# EAGLE design PQ60-BRK (EAGLE 7.2.0)
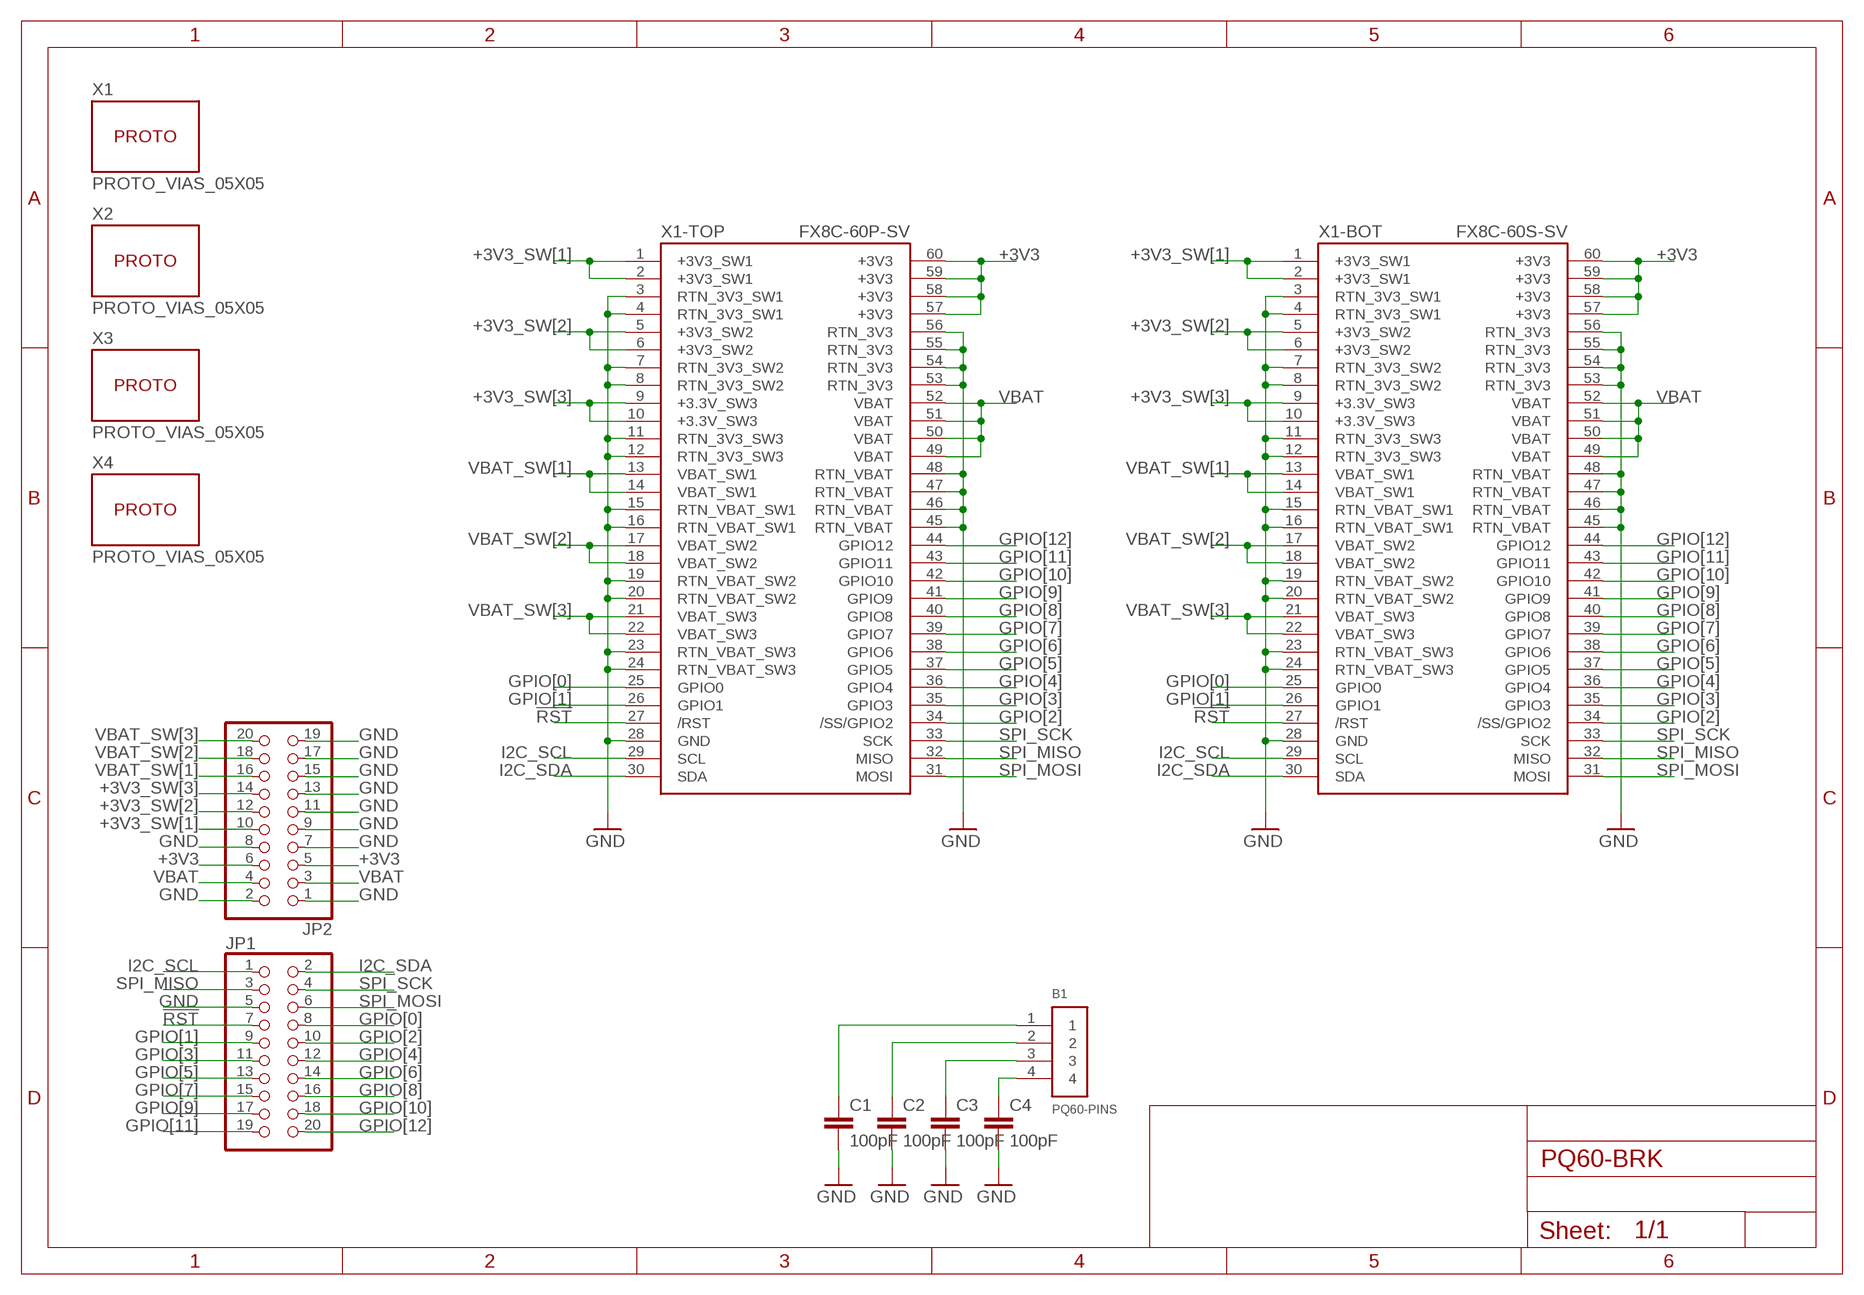
[diagram p0: schematic, sheet 1]

## Parts
B1  PQ60-PINS  [PQ60_PINS]
C1  100pF  C-EUC0402  [C0402]
C2  100pF  C-EUC0402  [C0402]
C3  100pF  C-EUC0402  [C0402]
C4  100pF  C-EUC0402  [C0402]
JP1  PINHD-2X10  [2X10]
JP2  PINHD-2X10  [2X10]
X1  PROTO_VIAS_05X05  [PROTO_VIAS_05X05]
X1-BOT  FX8C-60S-SV  FX8C-60-R2S-SV  [FX8C-60S-SV]
X1-TOP  FX8C-60P-SV  FX8C-60-R2P-SV  [FX8C-60P-SV]
X2  PROTO_VIAS_05X05  [PROTO_VIAS_05X05]
X3  PROTO_VIAS_05X05  [PROTO_VIAS_05X05]
X4  PROTO_VIAS_05X05  [PROTO_VIAS_05X05]

## Nets
!RST: JP1.7 X1-BOT.27(/RST) X1-TOP.27(/RST)
+3V3: JP2.5 JP2.6 X1-BOT.57(+3V3) X1-BOT.58(+3V3) X1-BOT.59(+3V3) X1-BOT.60(+3V3) X1-TOP.57(+3V3) X1-TOP.58(+3V3) X1-TOP.59(+3V3) X1-TOP.60(+3V3)
+3V3_SW[1]: JP2.10 X1-BOT.1(+3V3_SW1) X1-BOT.2(+3V3_SW1) X1-TOP.1(+3V3_SW1) X1-TOP.2(+3V3_SW1)
+3V3_SW[2]: JP2.12 X1-BOT.5(+3V3_SW2) X1-BOT.6(+3V3_SW2) X1-TOP.5(+3V3_SW2) X1-TOP.6(+3V3_SW2)
+3V3_SW[3]: JP2.14 X1-BOT.9(+3.3V_SW3) X1-BOT.10(+3.3V_SW3) X1-TOP.9(+3.3V_SW3) X1-TOP.10(+3.3V_SW3)
GND: C1.2 C2.2 C3.2 C4.2 JP1.5 JP2.1 JP2.2 JP2.7 JP2.8 JP2.9 JP2.11 JP2.13 JP2.15 JP2.17 JP2.19 X1-BOT.3(RTN_3V3_SW1) X1-BOT.4(RTN_3V3_SW1) X1-BOT.7(RTN_3V3_SW2) X1-BOT.8(RTN_3V3_SW2) X1-BOT.11(RTN_3V3_SW3) X1-BOT.12(RTN_3V3_SW3) X1-BOT.15(RTN_VBAT_SW1) X1-BOT.16(RTN_VBAT_SW1) X1-BOT.19(RTN_VBAT_SW2) X1-BOT.20(RTN_VBAT_SW2) X1-BOT.23(RTN_VBAT_SW3) X1-BOT.24(RTN_VBAT_SW3) X1-BOT.28(GND) X1-BOT.45(RTN_VBAT) X1-BOT.46(RTN_VBAT) X1-BOT.47(RTN_VBAT) X1-BOT.48(RTN_VBAT) X1-BOT.53(RTN_3V3) X1-BOT.54(RTN_3V3) X1-BOT.55(RTN_3V3) X1-BOT.56(RTN_3V3) X1-TOP.3(RTN_3V3_SW1) X1-TOP.4(RTN_3V3_SW1) X1-TOP.7(RTN_3V3_SW2) X1-TOP.8(RTN_3V3_SW2) X1-TOP.11(RTN_3V3_SW3) X1-TOP.12(RTN_3V3_SW3) X1-TOP.15(RTN_VBAT_SW1) X1-TOP.16(RTN_VBAT_SW1) X1-TOP.19(RTN_VBAT_SW2) X1-TOP.20(RTN_VBAT_SW2) X1-TOP.23(RTN_VBAT_SW3) X1-TOP.24(RTN_VBAT_SW3) X1-TOP.28(GND) X1-TOP.45(RTN_VBAT) X1-TOP.46(RTN_VBAT) X1-TOP.47(RTN_VBAT) X1-TOP.48(RTN_VBAT) X1-TOP.53(RTN_3V3) X1-TOP.54(RTN_3V3) X1-TOP.55(RTN_3V3) X1-TOP.56(RTN_3V3)
GPIO[0]: JP1.8 X1-BOT.25(GPIO0) X1-TOP.25(GPIO0)
GPIO[1]: JP1.9 X1-BOT.26(GPIO1) X1-TOP.26(GPIO1)
GPIO[2]: JP1.10 X1-BOT.34(/SS/GPIO2) X1-TOP.34(/SS/GPIO2)
GPIO[3]: JP1.11 X1-BOT.35(GPIO3) X1-TOP.35(GPIO3)
GPIO[4]: JP1.12 X1-BOT.36(GPIO4) X1-TOP.36(GPIO4)
GPIO[5]: JP1.13 X1-BOT.37(GPIO5) X1-TOP.37(GPIO5)
GPIO[6]: JP1.14 X1-BOT.38(GPIO6) X1-TOP.38(GPIO6)
GPIO[7]: JP1.15 X1-BOT.39(GPIO7) X1-TOP.39(GPIO7)
GPIO[8]: JP1.16 X1-BOT.40(GPIO8) X1-TOP.40(GPIO8)
GPIO[9]: JP1.17 X1-BOT.41(GPIO9) X1-TOP.41(GPIO9)
GPIO[10]: JP1.18 X1-BOT.42(GPIO10) X1-TOP.42(GPIO10)
GPIO[11]: JP1.19 X1-BOT.43(GPIO11) X1-TOP.43(GPIO11)
GPIO[12]: JP1.20 X1-BOT.44(GPIO12) X1-TOP.44(GPIO12)
I2C_SCL: JP1.1 X1-BOT.29(SCL) X1-TOP.29(SCL)
I2C_SDA: JP1.2 X1-BOT.30(SDA) X1-TOP.30(SDA)
N$3: B1.1 C1.1
N$4: B1.2 C2.1
N$5: B1.3 C3.1
N$6: B1.4 C4.1
SPI_MISO: JP1.3 X1-BOT.32(MISO) X1-TOP.32(MISO)
SPI_MOSI: JP1.6 X1-BOT.31(MOSI) X1-TOP.31(MOSI)
SPI_SCK: JP1.4 X1-BOT.33(SCK) X1-TOP.33(SCK)
VBAT: JP2.3 JP2.4 X1-BOT.49(VBAT) X1-BOT.50(VBAT) X1-BOT.51(VBAT) X1-BOT.52(VBAT) X1-TOP.49(VBAT) X1-TOP.50(VBAT) X1-TOP.51(VBAT) X1-TOP.52(VBAT)
VBAT_SW[1]: JP2.16 X1-BOT.13(VBAT_SW1) X1-BOT.14(VBAT_SW1) X1-TOP.13(VBAT_SW1) X1-TOP.14(VBAT_SW1)
VBAT_SW[2]: JP2.18 X1-BOT.17(VBAT_SW2) X1-BOT.18(VBAT_SW2) X1-TOP.17(VBAT_SW2) X1-TOP.18(VBAT_SW2)
VBAT_SW[3]: JP2.20 X1-BOT.21(VBAT_SW3) X1-BOT.22(VBAT_SW3) X1-TOP.21(VBAT_SW3) X1-TOP.22(VBAT_SW3)

## Library data of the parts
B1 = general:PQ60-PINS; OC_FARNELL: unknown
C1-C4 = rcl:C-EU: CAPACITOR, European symbol; MF: MULTICOMP; MPN: MC0402B101K250CT; OC_FARNELL: 1758898
JP1 JP2 = SparkFun-Connectors:PINHD-2X10: PIN HEADER
X1-X4 = dp_devices:PROTO_VIAS_05X05: 5x5 square pad 0.04 inch prototyping block
X1-BOT = PQ60:FX8C-60-R2; MF: HIROSE(HRS); MPN: FX8C-60S-SV5(91); OC_FARNELL: 1324698
X1-TOP = PQ60:FX8C-60-R2; MF: HIROSE(HRS); MPN: FX8C-60P-SV1(91); OC_FARNELL: 1324674

## Board
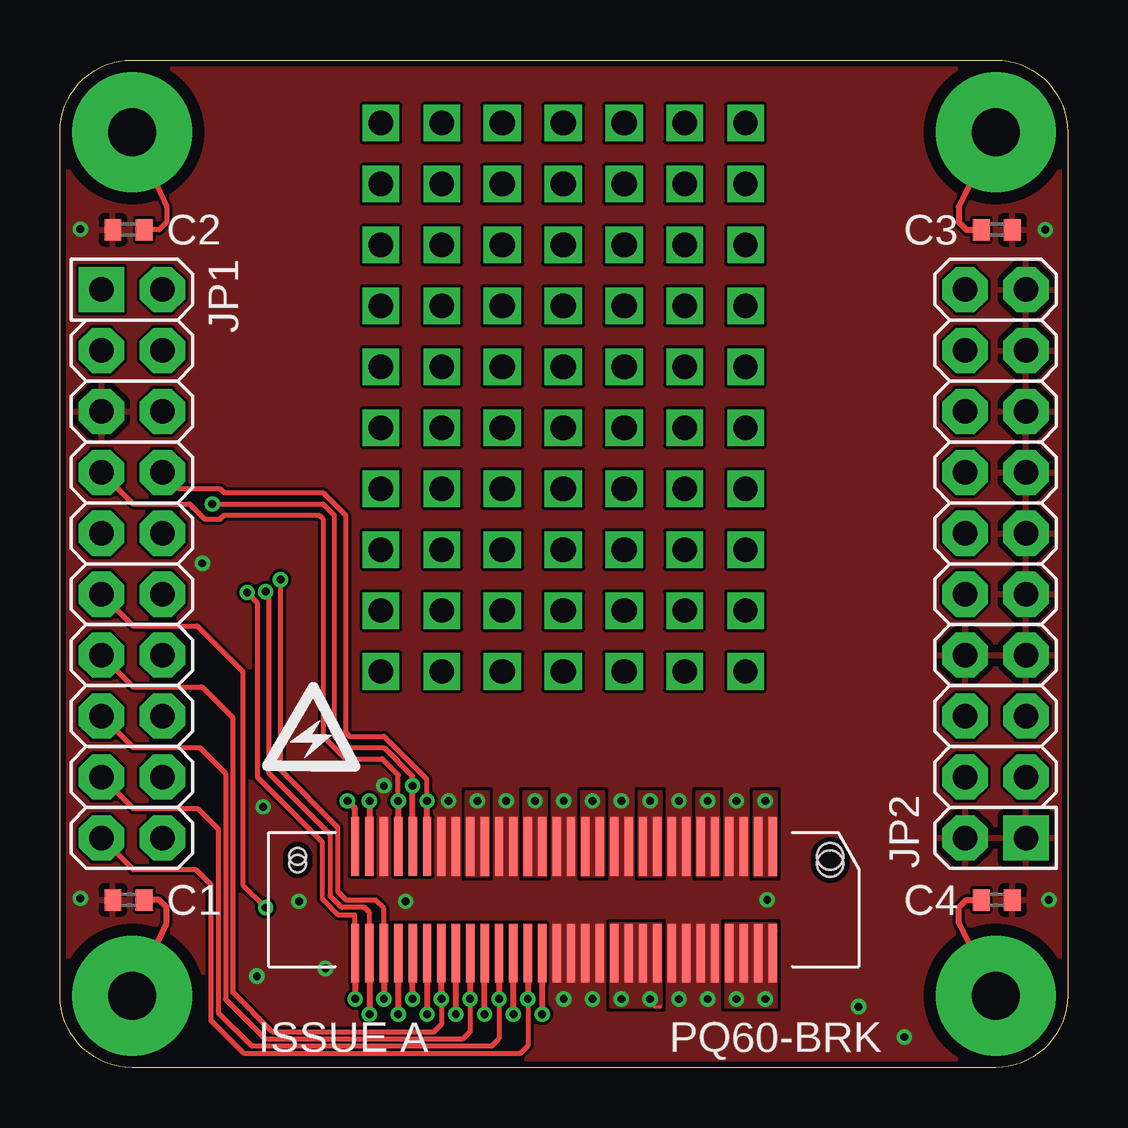
[diagram p1: board, top side]
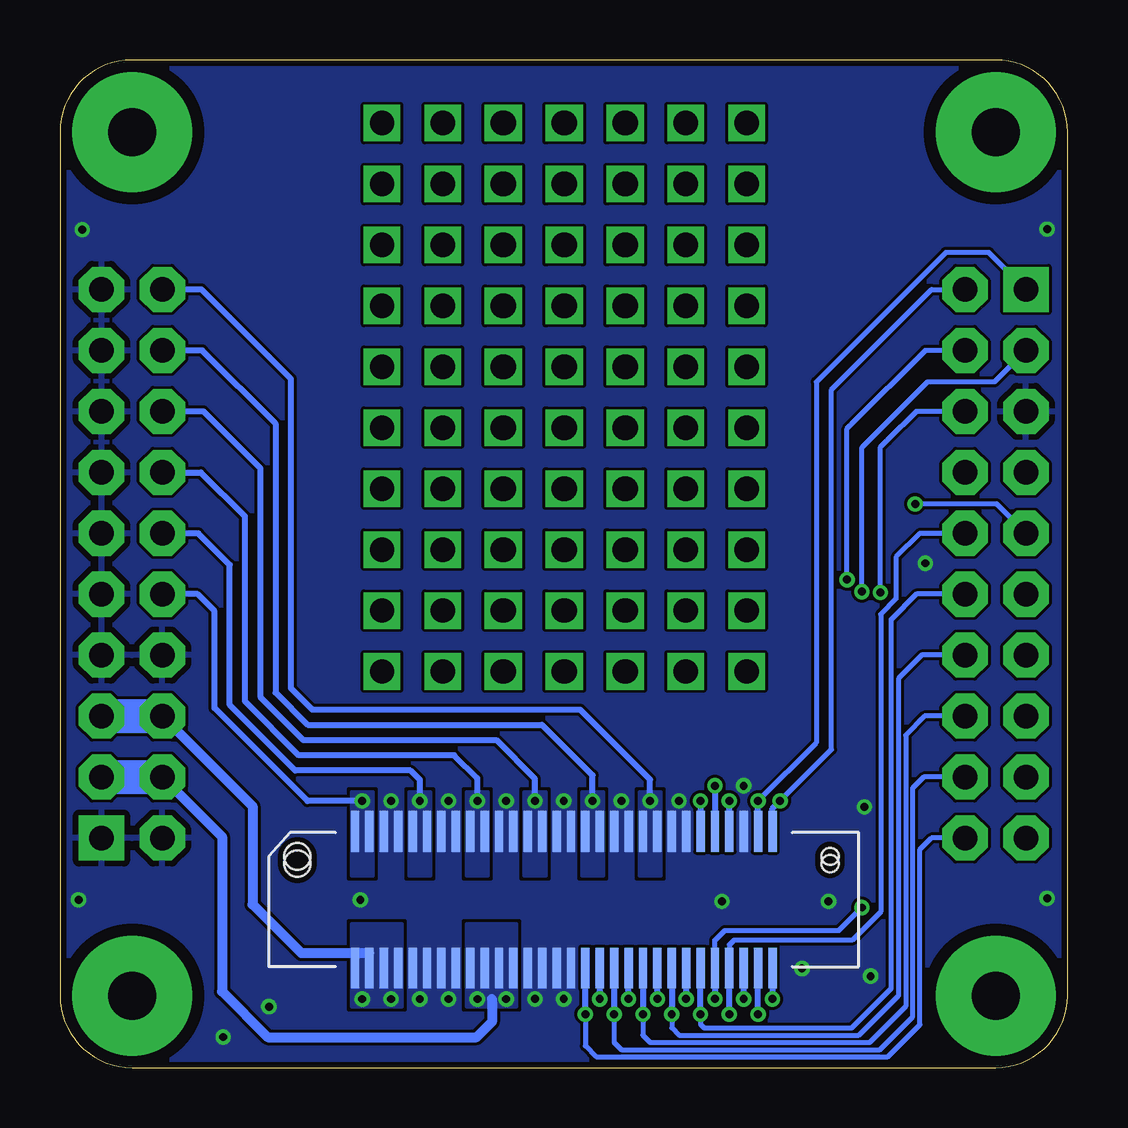
[diagram p2: board, bottom side, seen from below]

Size 42 x 42 mm. Coordinates in mm from the lower left corner, seen from the top.
Copper layers (1*16): Top 0.035mm / dielectric 1.5mm / Bottom 0.035mm
Design rules "dirt_cheap_dirty_boards.v1": minimum track width 5mil, minimum drill 12mil, track to track 5mil, track to pad 5mil, pad to pad 5mil, via to via 5mil, smd to smd 0mil, copper to edge 10mil, drill to drill 10mil, minimum pad ring 10mil, minimum via ring 6mil, stop-mask expansion 2mil, vias tented up to drill 25mil, thermal gap 10mil

### Footprints (pad centres in the part's own frame; a part is rotated, then mirrored left to right if it is on the bottom)
PQ60_PINS = drill 2 pad 5: 1 3,3; 2 3,39; 3 39,39; 4 39,3
C0402 = smd 0.7 x 0.9: 1 -0.65,0; 2 0.65,0
2X10 = drill 1.016 pad 1.88 square: 1 -11.43,-1.27 | drill 1.016 pad 1.88 octagon: 2 -11.43,1.27; 3 -8.89,-1.27; 4 -8.89,1.27; 5 -6.35,-1.27; 6 -6.35,1.27; 7 -3.81,-1.27; 8 -3.81,1.27; 9 -1.27,-1.27; 10 -1.27,1.27; 11 1.27,-1.27; 12 1.27,1.27; 13 3.81,-1.27; 14 3.81,1.27; 15 6.35,-1.27; 16 6.35,1.27; 17 8.89,-1.27; 18 8.89,1.27; 19 11.43,-1.27; 20 11.43,1.27
PROTO_VIAS_05X05 = drill 1.016 square: 1 -5.08,5.08; 2 -2.54,5.08; 3 0,5.08; 4 2.54,5.08; 5 5.08,5.08; 6 -5.08,2.54; 7 -2.54,2.54; 8 0,2.54; 9 2.54,2.54; 10 5.08,2.54; 11 -5.08,0; 12 -2.54,0; 13 0,0; 14 2.54,0; 15 5.08,0; 16 -5.08,-2.54; 17 -2.54,-2.54; 18 0,-2.54; 19 2.54,-2.54; 20 5.08,-2.54; 21 -5.08,-5.08; 22 -2.54,-5.08; 23 0,-5.08; 24 2.54,-5.08; 25 5.08,-5.08
FX8C-60S-SV = smd 0.35 x 1.7: 1 -8.7,2.85; 2 -8.1,2.85; 3 -7.5,2.85; 4 -6.9,2.85; 5 -6.3,2.85; 6 -5.7,2.85; 7 -5.1,2.85; 8 -4.5,2.85; 9 -3.9,2.85; 10 -3.3,2.85; 11 -2.7,2.85; 12 -2.1,2.85; 13 -1.5,2.85; 14 -0.9,2.85; 15 -0.3,2.85; 16 0.3,2.85; 17 0.9,2.85; 18 1.5,2.85; 19 2.1,2.85; 20 2.7,2.85; 21 3.3,2.85; 22 3.9,2.85; 23 4.5,2.85; 24 5.1,2.85; 25 5.7,2.85; 26 6.3,2.85; 27 6.9,2.85; 28 7.5,2.85; 29 8.1,2.85; 30 8.7,2.85; 31 8.7,-2.85; 32 8.1,-2.85; 33 7.5,-2.85; 34 6.9,-2.85; 35 6.3,-2.85; 36 5.7,-2.85; 37 5.1,-2.85; 38 4.5,-2.85; 39 3.9,-2.85; 40 3.3,-2.85; 41 2.7,-2.85; 42 2.1,-2.85; 43 1.5,-2.85; 44 0.9,-2.85; 45 0.3,-2.85; 46 -0.3,-2.85; 47 -0.9,-2.85; 48 -1.5,-2.85; 49 -2.1,-2.85; 50 -2.7,-2.85; 51 -3.3,-2.85; 52 -3.9,-2.85; 53 -4.5,-2.85; 54 -5.1,-2.85; 55 -5.7,-2.85; 56 -6.3,-2.85; 57 -6.9,-2.85; 58 -7.5,-2.85; 59 -8.1,-2.85; 60 -8.7,-2.85 | hole 1.1: -11.1,1.8 | hole 0.7: 11.1,1.8
FX8C-60P-SV = smd 0.35 x 2.45: 1 -8.7,-2.225; 2 -8.1,-2.225; 3 -7.5,-2.225; 4 -6.9,-2.225; 5 -6.3,-2.225; 6 -5.7,-2.225; 7 -5.1,-2.225; 8 -4.5,-2.225; 9 -3.9,-2.225; 10 -3.3,-2.225; 11 -2.7,-2.225; 12 -2.1,-2.225; 13 -1.5,-2.225; 14 -0.9,-2.225; 15 -0.3,-2.225; 16 0.3,-2.225; 17 0.9,-2.225; 18 1.5,-2.225; 19 2.1,-2.225; 20 2.7,-2.225; 21 3.3,-2.225; 22 3.9,-2.225; 23 4.5,-2.225; 24 5.1,-2.225; 25 5.7,-2.225; 26 6.3,-2.225; 27 6.9,-2.225; 28 7.5,-2.225; 29 8.1,-2.225; 30 8.7,-2.225; 31 8.7,2.225; 32 8.1,2.225; 33 7.5,2.225; 34 6.9,2.225; 35 6.3,2.225; 36 5.7,2.225; 37 5.1,2.225; 38 4.5,2.225; 39 3.9,2.225; 40 3.3,2.225; 41 2.7,2.225; 42 2.1,2.225; 43 1.5,2.225; 44 0.9,2.225; 45 0.3,2.225; 46 -0.3,2.225; 47 -0.9,2.225; 48 -1.5,2.225; 49 -2.1,2.225; 50 -2.7,2.225; 51 -3.3,2.225; 52 -3.9,2.225; 53 -4.5,2.225; 54 -5.1,2.225; 55 -5.7,2.225; 56 -6.3,2.225; 57 -6.9,2.225; 58 -7.5,2.225; 59 -8.1,2.225; 60 -8.7,2.225 | hole 1.1: -11.1,-1.5 | hole 0.7: 11.1,-1.5

### Placement (x,y rotation side)
B1  0,0 0 top
C1  2.86,6.99 180 top
C2  2.86,34.92 180 top
C3  39.05,34.92 0 top
C4  39.05,6.99 0 top
JP1  3,21 270 top
JP2  39,21 90 top
X1  18.46,34.29 0 top
X1-BOT  21,7 0 bottom
X1-TOP  21,7 180 top
X2  23.5,34.29 0 top
X3  23.5,21.59 0 top
X4  18.46,21.59 0 top

### Tracks (layer width: path | path; a pad name or v marks a point on that pad's centre or on a via)
!RST  (via drill 0.33)
  Top 0.203: JP1.7 3.04,23.5 5.4,23.5 6.03,22.86 6.67,22.86 6.83,23.03 10.79,23.03 10.96,22.86 10.96,13.8 11.9,12.87 13.43,12.87 14.1,12.2 v14.1,11.11
  Top 0.254: v14.1,11.11 X1-TOP.27
  Bottom 0.254: X1-BOT.27 v14.1,11.11
+3V3  (via drill 0.33)
  Top 0.127: 29.84,5.71 X1-TOP.60
  Bottom 0.406: JP2.6 33.97,10.89 33.97,6.8 31.95,4.78 X1-TOP.59
  Bottom 1.422: JP2.5 JP2.6
  other vias: 28.2,2.85 29.4,2.85
  pour Top (no thermals): 27.75,6 29.85,6 29.85,2.54 27.75,2.54
  pour Bottom (no thermals): 27.75,6 29.85,6 29.85,2.54 27.75,2.54
+3V3_SW[1]  (via drill 0.33)
  Bottom 0.254: JP2.10 36.27,19.73 35.56,19.02 35.56,14.99 31.68,11.11 v29.4,11.11
  pour Top (no thermals): 28.95,11.5 29.85,11.5 29.85,8 28.95,8
  pour Bottom (no thermals): 28.95,11.5 29.85,11.5 29.85,8 28.95,8
+3V3_SW[2]  (via drill 0.33)
  Bottom 0.254: JP2.12 36.24,22.27 34.92,20.96 34.92,15.11 32.19,12.38 27.39,12.38 27,12 v27,11.11
  pour Top (no thermals): 26.55,11.5 27.45,11.5 27.45,8 26.55,8
  pour Bottom (no thermals): 26.55,11.5 27.45,11.5 27.45,8 26.55,8
+3V3_SW[3]  (via drill 0.33)
  Bottom 0.254: JP2.14 36.13,24.81 34.29,22.97 34.29,15.26 32.05,13.02 25.56,13.02 24.6,12.05 v24.6,11.11
  pour Top (no thermals): 24.15,11.5 25.05,11.5 25.05,8 24.15,8
  pour Bottom (no thermals): 24.15,11.5 25.05,11.5 25.05,8 24.15,8
GND  (via drill 0.33)
  other vias: 9.96,6.92 29.48,6.99 27,2.85 25.8,2.85 22.2,2.86 21,2.86 16.2,11.11 18.6,11.11 21,11.11 23.4,11.11 25.8,11.11 28.2,11.11 11.06,4.13 33.29,2.54 35.2,1.27 41.23,6.99 41.08,34.92 0.85,7.05 14.41,6.92 8.21,3.81 0.85,34.95 8.47,10.86 5.93,21.02 13.5,11.75
  pour Top (rank 6): 0,42 42,42 42,0 0,0
  pour Bottom (rank 6): 0,42 42,42 42,0 0,0
  pour Bottom (rank 4, no thermals): 10.75,12.7 30.75,12.7 30.75,0.95 10.75,0.95
  pour Top (rank 4, no thermals): 10.75,12.7 30.75,12.7 30.75,0.95 10.75,0.95
GPIO[0]  (via drill 0.33)
  Top 0.203: JP1.8 4.95,24.13 6.67,24.13 6.83,23.96 10.96,23.96 11.9,23.03 11.9,13.97 12.06,13.8 13.5,13.8 15.3,12.01 v15.3,11.11
  Top 0.254: X1-TOP.25 v15.3,11.11
  Bottom 0.127: 15.24,10.79 15.3,10.79
  Bottom 0.254: v15.3,11.11 15.3,10.79 X1-BOT.25
GPIO[1]  (via drill 0.33)
  Top 0.127: 14.61,8.89 X1-TOP.26
  Top 0.203: v6.35,23.5 10.96,23.5 11.43,23.03 11.43,13.82 11.91,13.34 13.5,13.34 14.7,12.14 v14.7,11.75
  Top 0.254: X1-TOP.26 v14.7,11.75
  Bottom 0.203: JP1.9 2.96,23.5 v6.35,23.5
  Bottom 0.254: v14.7,11.75 X1-BOT.26
GPIO[2]  (via drill 0.33)
  Top 0.254: X1-TOP.34 v14.1,2.22
  Bottom 0.203: JP1.10 6.16,22.27 7.15,21.27 7.15,19.55 7.79,18.9 7.79,6.5 8.97,5.31 13.9,5.31 14.1,5.12 X1-BOT.34
  Bottom 0.254: v14.1,2.22 X1-BOT.34
GPIO[3]  (via drill 0.33)
  Top 0.203: JP1.11 3.04,18.41 5.71,18.41 7.62,16.51 7.62,7.62 v8.57,6.67
  Top 0.254: v14.7,2.86 X1-TOP.35
  Bottom 0.203: X1-BOT.35 14.7,5.3 14.29,5.71 9.53,5.71 v8.57,6.67
  Bottom 0.254: X1-BOT.35 v14.7,2.86
GPIO[4]  (via drill 0.33)
  Top 0.127: 15.24,5.08 X1-TOP.36
  Top 0.254: X1-TOP.36 v15.3,2.22
  Bottom 0.203: v15.3,2.22 15.3,1.8 15.15,1.65 9,1.65 7.35,3.3 7.35,18.68 6.3,19.73 JP1.12
  Bottom 0.254: v15.3,2.22 X1-BOT.36
GPIO[5]  (via drill 0.33)
  Top 0.203: v15.9,2.86 15.9,1.8 15.6,1.5 8.85,1.5 7.2,3.15 7.2,14.6 5.92,15.88 3.04,15.88 JP1.13
  Top 0.254: v15.9,2.86 X1-TOP.37
  Bottom 0.254: X1-BOT.37 v15.9,2.86
GPIO[6]  (via drill 0.33)
  Top 0.254: v16.5,2.22 X1-TOP.38
  Bottom 0.127: 16.51,2.54 16.5,2.54
  Bottom 0.203: v16.5,2.22 16.5,1.65 16.2,1.35 8.7,1.35 7.05,3 7.05,16.21 6.07,17.19 JP1.14
  Bottom 0.254: X1-BOT.38 16.5,2.54 v16.5,2.22
GPIO[7]  (via drill 0.33)
  Top 0.203: v17.1,2.86 17.1,1.5 16.8,1.2 8.55,1.2 6.9,2.85 6.9,12.26 5.83,13.34 3.04,13.34 JP1.15
  Top 0.254: X1-TOP.39 v17.1,2.86 arc-90 v17.1,2.86
  Bottom 0.127: 17.14,4.45 X1-BOT.39
  Bottom 0.254: v17.1,2.86 X1-BOT.39 arc-90 X1-BOT.39
GPIO[8]  (via drill 0.33)
  Top 0.254: v17.7,2.22 X1-TOP.40
  Bottom 0.203: v17.7,2.22 17.7,1.35 17.4,1.05 8.25,1.05 6.75,2.55 6.75,13.86 5.96,14.65 JP1.16
  Bottom 0.254: X1-BOT.40 v17.7,2.22
GPIO[9]  (via drill 0.33)
  Top 0.203: v18.3,2.86 18.3,1.2 18,0.9 7.99,0.9 6.6,2.29 6.6,9.94 5.75,10.79 3.04,10.79 JP1.17
  Top 0.254: X1-TOP.41 v18.3,2.86
  Bottom 0.254: v18.3,2.86 X1-BOT.41
GPIO[10]  (via drill 0.33)
  Top 0.254: v18.9,2.22 X1-TOP.42
  Bottom 0.203: v18.9,2.22 18.9,1.05 18.6,0.75 7.82,0.75 6.45,2.12 6.45,11.65 5.99,12.11 JP1.18
  Bottom 0.254: X1-BOT.42 v18.9,2.22
GPIO[11]  (via drill 0.33)
  Top 0.203: v19.5,2.86 19.5,0.9 19.2,0.6 7.66,0.6 6.3,1.96 6.3,7.62 5.67,8.26 3.04,8.26 JP1.19
  Top 0.254: X1-TOP.43 v19.5,2.86
  Bottom 0.254: v19.5,2.86 X1-BOT.43
GPIO[12]  (via drill 0.33)
  Top 0.254: X1-TOP.44 v20.1,2.22
  Bottom 0.203: v20.1,2.22 20.1,0.9 19.65,0.45 7.49,0.45 6.15,1.79 6.15,9.09 5.67,9.57 JP1.20
  Bottom 0.254: v20.1,2.22 X1-BOT.44
I2C_SCL  (via drill 0.33)
  Top 0.254: v12.9,11.11 X1-TOP.29
  Bottom 0.203: JP1.1 3.27,33.97 5.08,33.97 10.48,28.57 10.48,13.54 v12.9,11.11
  Bottom 0.254: X1-BOT.29 v12.9,11.11
I2C_SDA  (via drill 0.33)
  Top 0.254: X1-TOP.30 12.3,10.79 v11.98,11.11
  Bottom 0.203: JP1.2 5.67,32.43 9.84,28.26 9.84,13.25 v11.98,11.11
  Bottom 0.254: X1-BOT.30 12.3,10.79 v11.98,11.11
N$3
  Top 0.254: B1.1 4.45,6.03 4.45,6.67 4.13,6.99 C1.1
N$4
  Top 0.203: B1.2 4.45,35.88 4.45,35.24 4.13,34.92 C2.1
N$5
  Top 0.254: B1.3 37.47,35.88 37.47,35.24 37.78,34.92 C3.1
N$6
  Top 0.254: B1.4 37.47,6.03 37.47,6.67 37.78,6.99 C4.1
SPI_MISO  (via drill 0.33)
  Top 0.203: X1-TOP.32 12.9,6.47 12.7,6.67 11.75,6.67 11.25,7.17 11.25,9.72 8.7,12.27 8.7,19.71 v8.57,19.84
  Top 0.254: X1-TOP.32 v12.9,2.22
  Bottom 0.203: JP1.3 3.04,28.57 5.84,28.57 8.57,25.84 v8.57,19.84
  Bottom 0.254: v12.9,2.22 X1-BOT.32
SPI_MOSI  (via drill 0.33)
  Top 0.203: X1-TOP.31 12.3,6.35 11.62,6.35 10.95,7.03 10.95,9.39 8.24,12.1 8.24,19.17 8.24,19.36 v7.8,19.8
  Top 0.254: X1-TOP.31 v12.3,2.86
  Bottom 0.203: JP1.6 6.3,27.35 7.53,26.13 7.8,25.86 v7.8,19.8
  Bottom 0.254: X1-BOT.31 v12.3,2.86
SPI_SCK  (via drill 0.33)
  Top 0.203: X1-TOP.33 13.5,6.63 13.14,6.99 11.94,6.99 11.58,7.34 11.58,10.01 9.19,12.4 v9.19,20.34
  Top 0.254: X1-TOP.33 v13.5,2.86
  Bottom 0.203: JP1.4 5.93,29.89 9.02,26.8 9.19,26.63 v9.19,20.34
  Bottom 0.254: v13.5,2.86 X1-BOT.33
VBAT  (via drill 0.33)
  Top 0.127: 24.77,2.54 25.05,2.54
  Bottom 0.406: 24,2.86 24,1.91 24.64,1.27 33.34,1.27 35.24,3.17 35.24,9.62 JP2.4
  Bottom 1.422: JP2.3 JP2.4
  other vias: 24.6,2.85 23.4,2.85
  pour Bottom (no thermals): 22.96,6 25.05,6 25.05,2.54 22.96,2.54
  pour Top (no thermals): 22.96,6 25.05,6 25.05,2.54 22.96,2.54
VBAT_SW[1]  (via drill 0.33)
  Bottom 0.254: JP2.16 36.02,27.35 33.66,24.99 33.66,15.45 31.86,13.65 23.81,13.65 22.2,12.04 v22.2,11.11
  pour Top (no thermals): 21.75,11.5 22.65,11.5 22.65,8 21.75,8
  pour Bottom (no thermals): 21.75,11.5 22.65,11.5 22.65,8 21.75,8
VBAT_SW[2]  (via drill 0.33)
  Bottom 0.254: JP2.18 36.07,29.89 33.02,26.84 33.02,15.63 31.67,14.29 21.91,14.29 19.8,12.18 v19.8,11.11
  pour Bottom (no thermals): 19.35,11.5 20.25,11.5 20.25,8 19.35,8
  pour Top (no thermals): 19.35,11.5 20.25,11.5 20.25,8 19.35,8
VBAT_SW[3]  (via drill 0.33)
  Bottom 0.254: JP2.20 36.1,32.43 32.38,28.71 32.38,15.82 31.49,14.92 20.32,14.92 17.4,12 v17.4,11.11
  pour Top (no thermals): 16.95,11.5 17.85,11.5 17.85,8 16.95,8
  pour Bottom (no thermals): 16.95,11.5 17.85,11.5 17.85,8 16.95,8

### Text on the board
tNames: ISSUE A | PQ60-BRK